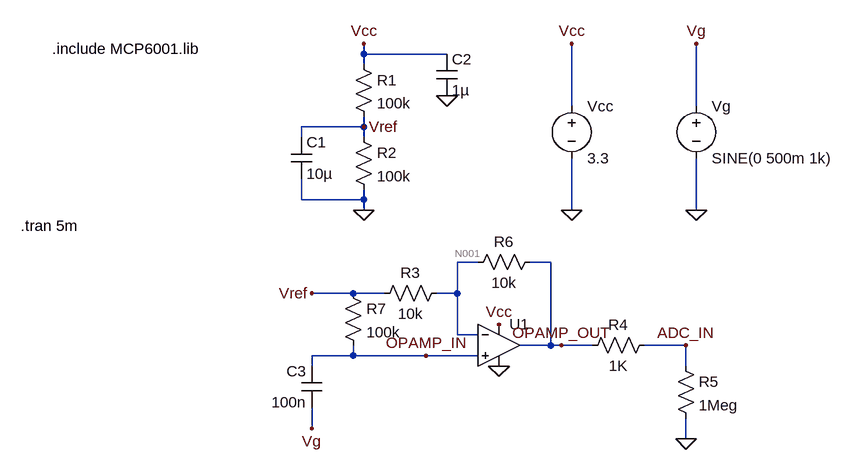
[diagram p0: schematic Draft1.asc]
Draft1.asc, the LTspice schematic file:
Version 4
SHEET 1 932 680
WIRE 192 -128 192 -144
WIRE 320 -128 192 -128
WIRE 192 -112 192 -128
WIRE 512 -48 512 -144
WIRE 704 -48 704 -144
WIRE 192 -16 192 -32
WIRE 192 -16 96 -16
WIRE 96 0 96 -16
WIRE 192 0 192 -16
WIRE 96 96 96 64
WIRE 192 96 192 80
WIRE 192 96 96 96
WIRE 192 112 192 96
WIRE 512 112 512 32
WIRE 704 112 704 32
WIRE 368 192 336 192
WIRE 480 192 448 192
WIRE 176 240 112 240
WIRE 224 240 176 240
WIRE 336 240 336 192
WIRE 336 240 304 240
WIRE 336 304 336 240
WIRE 368 304 336 304
WIRE 480 320 480 192
WIRE 480 320 432 320
WIRE 496 320 480 320
WIRE 544 320 496 320
WIRE 688 320 624 320
WIRE 176 336 176 320
WIRE 176 336 112 336
WIRE 288 336 176 336
WIRE 368 336 288 336
WIRE 112 352 112 336
WIRE 688 352 688 320
WIRE 112 448 112 416
WIRE 688 464 688 432
FLAG 512 112 0
FLAG 512 -144 Vcc
FLAG 704 112 0
FLAG 704 -144 Vg
FLAG 192 112 0
FLAG 192 -144 Vcc
FLAG 192 -16 Vref
FLAG 320 -64 0
FLAG 112 448 Vg
FLAG 288 336 OPAMP_IN
FLAG 112 240 Vref
FLAG 400 288 Vcc
FLAG 400 352 0
FLAG 496 320 OPAMP_OUT
FLAG 688 320 ADC_IN
FLAG 688 464 0
SYMBOL voltage 512 -64 R0
WINDOW 123 0 0 Left 0
WINDOW 39 0 0 Left 0
SYMATTR InstName Vcc
SYMATTR Value 3.3
SYMBOL voltage 704 -64 R0
WINDOW 123 0 0 Left 0
WINDOW 39 0 0 Left 0
SYMATTR InstName Vg
SYMATTR Value SINE(0 500m 1k)
SYMBOL OpAmps\\UniversalOpAmp 400 320 R0
SYMATTR InstName U1
SYMBOL res 176 -128 R0
SYMATTR InstName R1
SYMATTR Value 100k
SYMBOL res 176 -16 R0
SYMATTR InstName R2
SYMATTR Value 100k
SYMBOL cap 80 0 R0
SYMATTR InstName C1
SYMATTR Value 10µ
SYMBOL cap 304 -128 R0
SYMATTR InstName C2
SYMATTR Value 1µ
SYMBOL cap 128 416 R180
WINDOW 0 24 56 Left 2
WINDOW 3 24 8 Left 2
SYMATTR InstName C3
SYMATTR Value 100n
SYMBOL res 640 304 R90
WINDOW 0 0 56 VBottom 2
WINDOW 3 32 56 VTop 2
SYMATTR InstName R4
SYMATTR Value 1K
SYMBOL res 672 336 R0
SYMATTR InstName R5
SYMATTR Value 1Meg
SYMBOL res 320 224 R90
WINDOW 0 0 56 VBottom 2
WINDOW 3 32 56 VTop 2
SYMATTR InstName R3
SYMATTR Value 10k
SYMBOL res 464 176 R90
WINDOW 0 0 56 VBottom 2
WINDOW 3 32 56 VTop 2
SYMATTR InstName R6
SYMATTR Value 10k
SYMBOL res 160 224 R0
SYMATTR InstName R7
SYMATTR Value 100k
TEXT -336 136 Left 2 !.tran 5m
TEXT -288 -136 Left 2 !.include MCP6001.lib

The netlist it stands for:
* Draft1.asc
Vcc Vcc 0 3.3
Vg Vg 0 SINE(0 500m 1k)
XU1 OPAMP_IN N001 Vcc 0 OPAMP_OUT level1 Avol=1Meg GBW=10Meg Vos=0 En=0 Enk=0 In=0 Ink=0 Rin=500Meg  ; pins In+ In- V+ V- OUT
R1 Vcc Vref 100k
R2 Vref 0 100k
C1 Vref 0 10µ
C2 Vcc 0 1µ
C3 Vg OPAMP_IN 100n
R4 ADC_IN OPAMP_OUT 1K
R5 ADC_IN 0 1Meg
R3 N001 Vref 10k
R6 OPAMP_OUT N001 10k
R7 Vref OPAMP_IN 100k
.tran 5m
.include MCP6001.lib
.lib UniversalOpAmp1.lib
.backanno
.end

* Results of the author's LTspice run, read from the files saved beside the schematic
* Operating Point, zero values left out:
*   V(vcc) = 3.3 V
*   V(n001) = 1.65 V
*   V(opamp_in) = 1.65 V
*   V(opamp_out) = 1.65 V
*   V(vref) = 1.65 V
*   V(adc_in) = 1.648 V
*   I(R1) = 16.5 µA
*   I(R2) = 16.5 µA
*   I(R4) = -1.648 µA
*   I(R5) = 1.648 µA
*   I(R3) = -164.8 pA
*   I(R6) = -164.8 pA
*   I(Vcc) = -16.5 µA
*   Ix(u1:3) = 3.3 nA
*   Ix(u1:4) = -3.3 nA
*   Ix(u1:5) = -1.648 µA
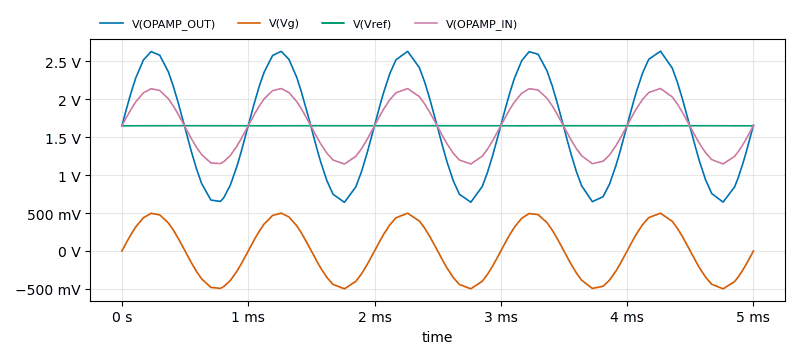
[diagram p1: Transient Analysis of Draft1.asc, plotted from the saved traces]
* Transient Analysis, 1 run:
*   V(OPAMP_OUT): min 641.3 mV, max 2.633 V, average 1.638 V, rms 1.78 V, last 1.657 V
*   V(Vg): min -498.7 mV, max 498.7 mV, average 217.4 µV, rms 349.5 mV, last 0 V
*   V(Vref): min 1.65 V, max 1.652 V, average 1.651 V, rms 1.651 V, last 1.65 V
*   V(OPAMP_IN): min 1.146 V, max 2.142 V, average 1.644 V, rms 1.681 V, last 1.653 V